# EAGLE schematic TEST (EAGLE 6.6.0)
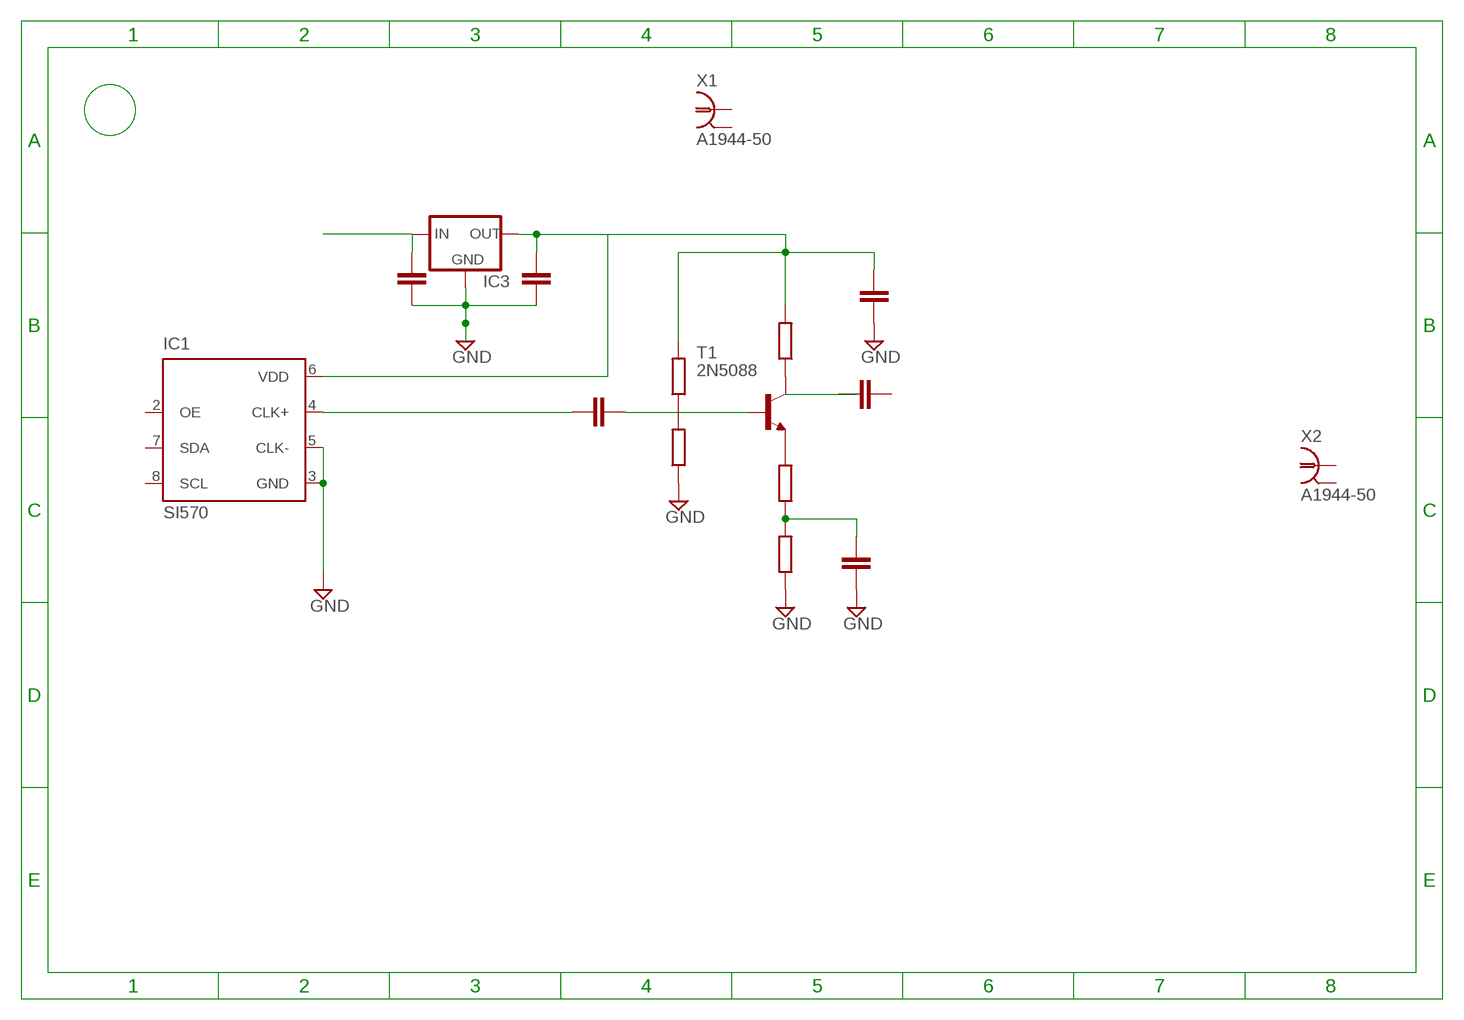
[diagram p0: schematic, sheet 1]

## Parts
IC1  SI570  [8-PIN]
IC3  78XXL  [78XXL]
T1  2N5088  [TO92]
X1  A1944-50  [A1944]
X2  A1944-50  [A1944]

## Nets
GND: IC1.3(GND) IC1.5(CLK-) IC3.GND
N$1: IC3.IN
N$2: IC1.6(VDD) IC3.OUT
N$3: IC1.4(CLK+)
N$4: T1.2(B)
Unconnected: IC1.2(OE) IC1.7(SDA) IC1.8(SCL) T1.1(C) T1.3(E) X1.1 X1.2 X1.3 X1.4 X1.5 X2.1 X2.2 X2.3 X2.4 X2.5

## Library data of the parts
IC1 = silabs:SI570: ANY-RATE I2C PROGRAMMABLE XO/VCXO Source: si570.pdf; OC_FARNELL: unknown; OC_NEWARK: unknown
IC3 = v-reg:78XXL: VOLTAGE REGULATOR
T1 = transistor:2N5088: NPN TRANSISTOR
X1 X2 = con-coax:A1944-50: BNC CONNECTOR 50 Ohm distributor Buerklin 78F2475; OC_FARNELL: unknown; OC_NEWARK: unknown